# Altium schematic sheet FPGA-Camera-AWR.SchDoc: =ProjectTitle
size A3; Author: Jaime I. Chait; Organization: NWES LLC; Address1: 111 SW 5th Ave, STE 3150; Address2: Portland, OR 97204; SheetNumber: 14; SheetTotal: 19
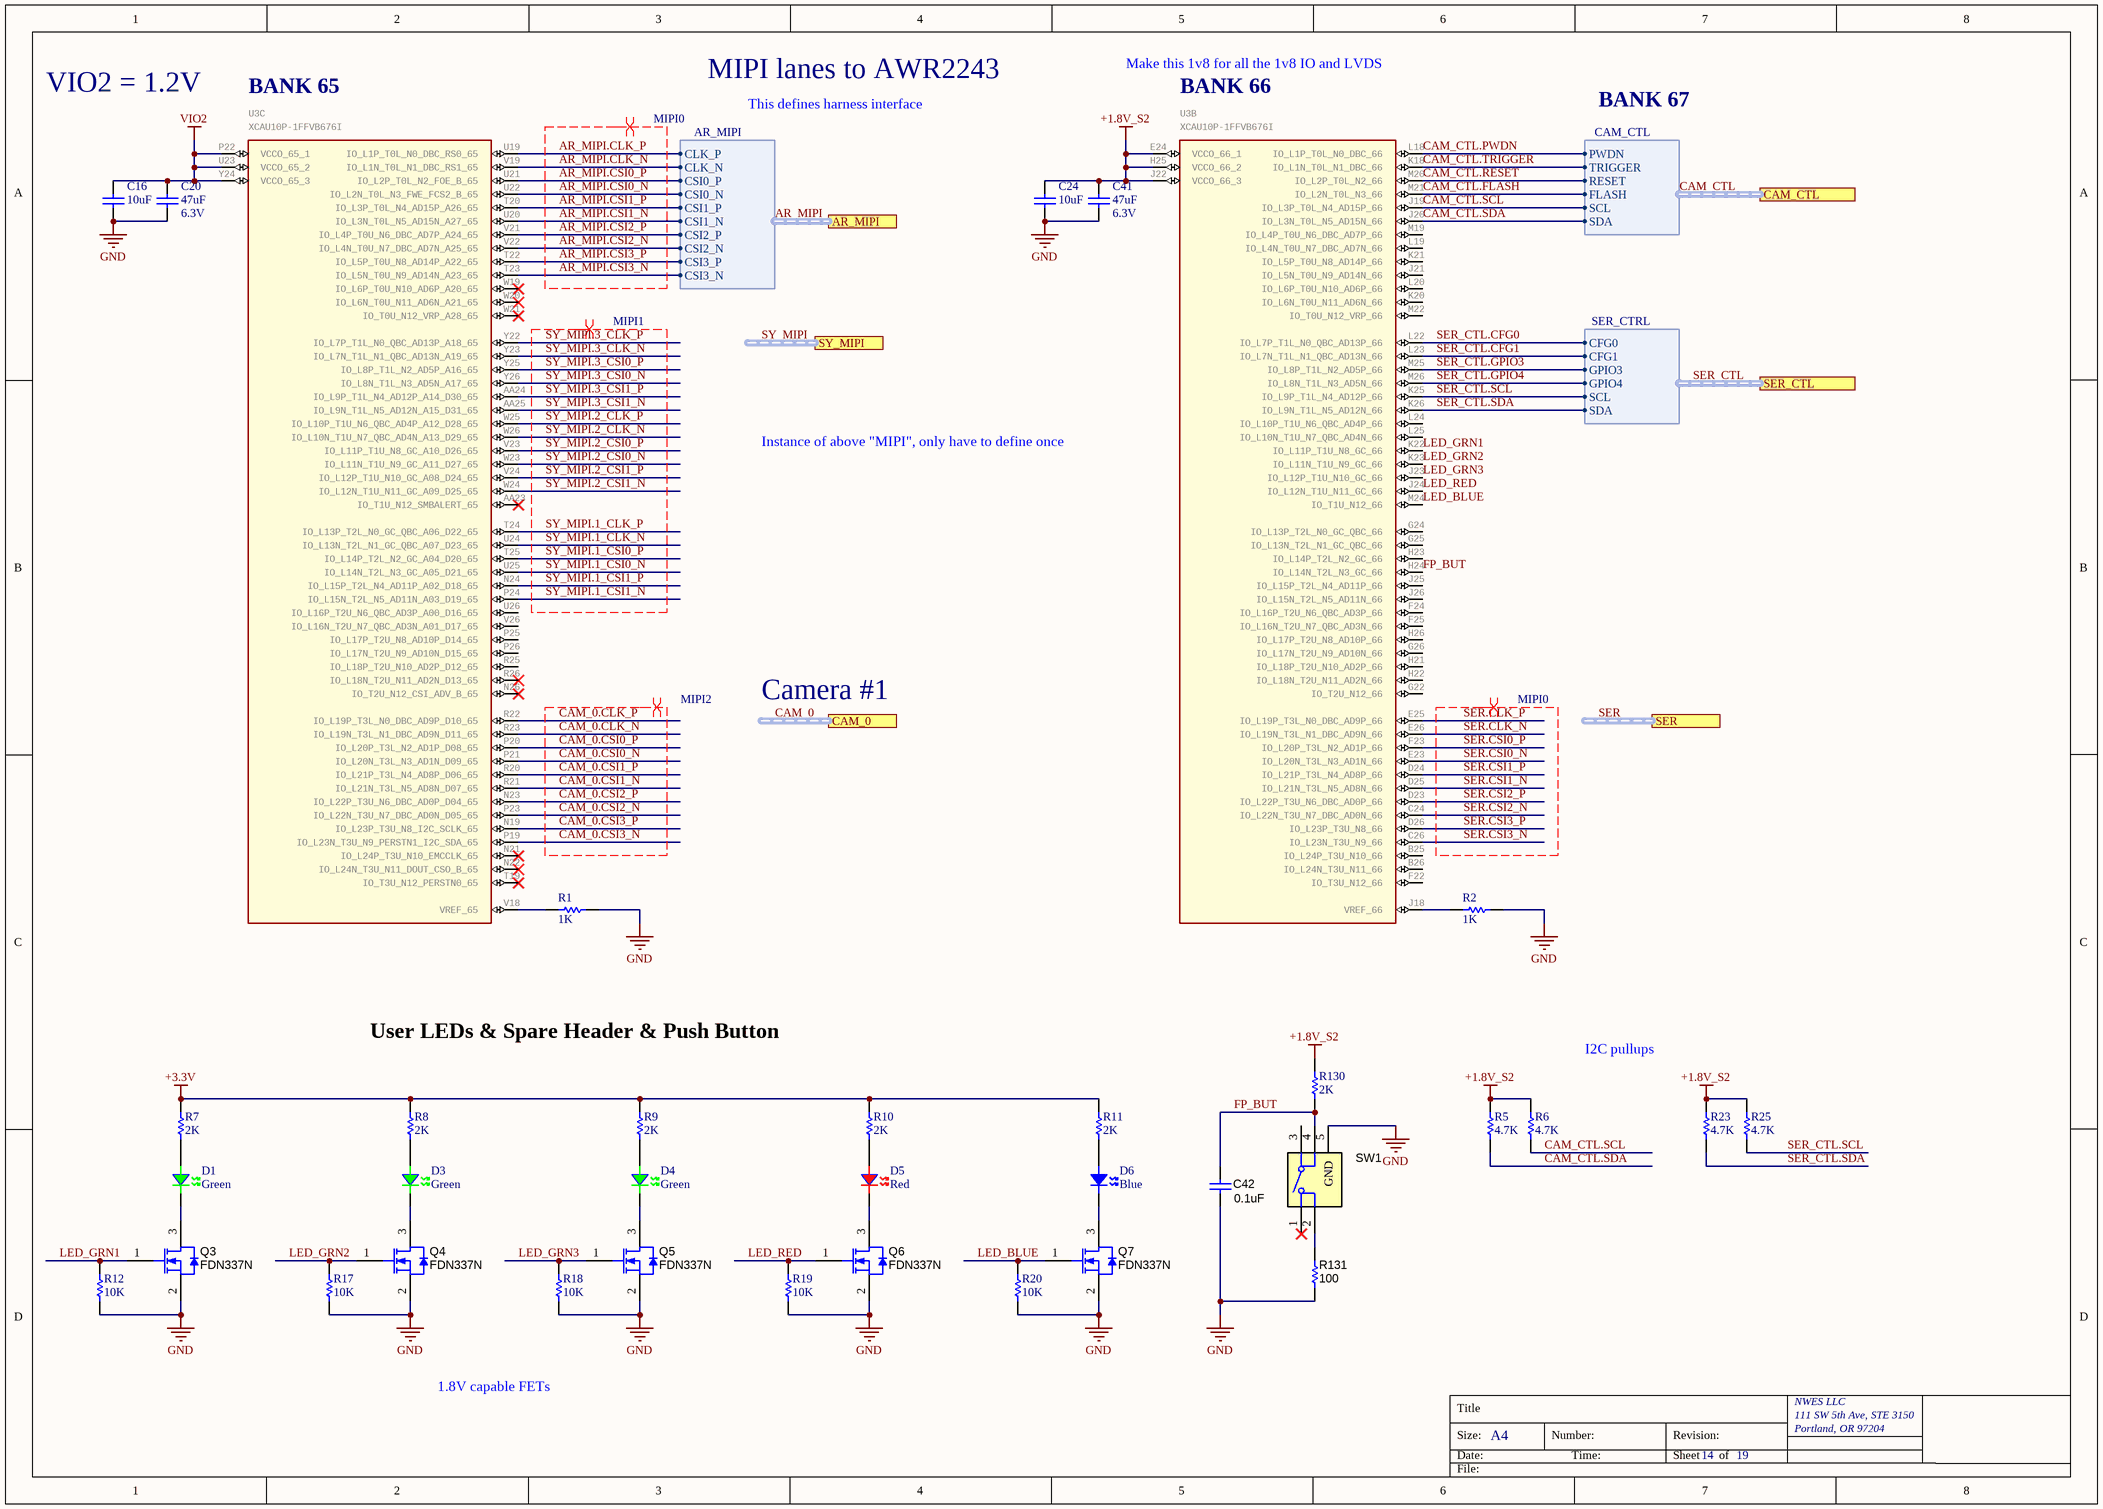
[diagram p0: FPGA-Camera-AWR.SchDoc]

## Parts
C16  10uF  [CAPC1005X90]
C20  47uF  Voltage Rating: 6.3V  [CAPC2012X145USR]
C24  10uF  [CAPC1005X90]
C41  47uF  Voltage Rating: 6.3V  [CAPC2012X145USR]
C42  ValueDisplayed: 0.1uF  [0402L]  (hidden comment: GCM155R71C104KA55D)
D1  Green  [LED_0603]
D3  Green  [LED_0603]
D4  Green  [LED_0603]
D5  Red  [LED_0603]
D6  Blue  [LED_0603]
Q3  FDN337N  [SOT-23]
Q4  FDN337N  [SOT-23]
Q5  FDN337N  [SOT-23]
Q6  FDN337N  [SOT-23]
Q7  FDN337N  [SOT-23]
R1  1K  [RESC1005X40USR]
R2  1K  [RESC1005X40USR]
R5  4.7K  [RESC1005X40USR]
R6  4.7K  [RESC1005X40USR]
R7  2K  [RESC1005X40USR]
R8  2K  [RESC1005X40USR]
R9  2K  [RESC1005X40USR]
R10  2K  [RESC1005X40USR]
R11  2K  [RESC1005X40USR]
R12  10K  [RESC1005X40USR]
R17  10K  [RESC1005X40USR]
R18  10K  [RESC1005X40USR]
R19  10K  [RESC1005X40USR]
R20  10K  [RESC1005X40USR]
R23  4.7K  [RESC1005X40USR]
R25  4.7K  [RESC1005X40USR]
R130  2K  [RESC1005X40USR]
R131  ValueDisplayed: 100  [0402L]  (hidden comment: ERJ-2GEJ101X)
SW1  KMR243GLFG  [SW_KMR243GLFG]  (value not drawn)
U3  XCAU10P-1FFVB676I  [676-FCBGA (27x27)]  (parts B,C of 16)

## Ports
AR_MIPI (harness AR_MIPI), CAM_0 (harness MIPI), CAM_CTL (harness CAM_CTL), SER (harness MIPI), SER_CTL (harness SER_CTRL), SY_MIPI (harness SY_MIPI)

## Harnesses
AR_MIPI: CLK_P, CLK_N, CSI0_P, CSI0_N, CSI1_P, CSI1_N, CSI2_P, CSI2_N, CSI3_P, CSI3_N
CAM_CTL: PWDN, TRIGGER, RESET, FLASH, SCL, SDA
SER_CTRL: CFG0, CFG1, GPIO3, GPIO4, SCL, SDA

## Nets
+1.8V_S2: C24.2 C41.1 R5.2 R6.2 R23.2 R25.2 R130.1 U3.E24(VCCO_66_1) U3.H25(VCCO_66_2) U3.J22(VCCO_66_3)
+3.3V: R7.2 R8.2 R9.2 R10.2 R11.2
GND: C16.1 C20.2 C24.1 C41.2 C42.1 Q3.2(S) Q4.2(S) Q5.2(S) Q6.2(S) Q7.2(S) R1.2 R2.2 R12.1 R17.1 R18.1 R19.1 R20.1 R131.1 SW1.5(GND)
VIO2: C16.2 C20.1 U3.P22(VCCO_65_1) U3.U23(VCCO_65_2) U3.Y24(VCCO_65_3)
AR_MIPI.CLK_N: U3.V19(IO_L1N_T0L_N1_DBC_RS1_65) ; port AR_MIPI.CLK_N
AR_MIPI.CLK_P: U3.U19(IO_L1P_T0L_N0_DBC_RS0_65) ; port AR_MIPI.CLK_P
AR_MIPI.CSI0_N: U3.U22(IO_L2N_T0L_N3_FWE_FCS2_B_65) ; port AR_MIPI.CSI0_N
AR_MIPI.CSI0_P: U3.U21(IO_L2P_T0L_N2_FOE_B_65) ; port AR_MIPI.CSI0_P
AR_MIPI.CSI1_N: U3.U20(IO_L3N_T0L_N5_AD15N_A27_65) ; port AR_MIPI.CSI1_N
AR_MIPI.CSI1_P: U3.T20(IO_L3P_T0L_N4_AD15P_A26_65) ; port AR_MIPI.CSI1_P
AR_MIPI.CSI2_N: U3.V22(IO_L4N_T0U_N7_DBC_AD7N_A25_65) ; port AR_MIPI.CSI2_N
AR_MIPI.CSI2_P: U3.V21(IO_L4P_T0U_N6_DBC_AD7P_A24_65) ; port AR_MIPI.CSI2_P
AR_MIPI.CSI3_N: U3.T23(IO_L5N_T0U_N9_AD14N_A23_65) ; port AR_MIPI.CSI3_N
AR_MIPI.CSI3_P: U3.T22(IO_L5P_T0U_N8_AD14P_A22_65) ; port AR_MIPI.CSI3_P
CAM_0.CLK_N: U3.R23(IO_L19N_T3L_N1_DBC_AD9N_D11_65)
CAM_0.CLK_P: U3.R22(IO_L19P_T3L_N0_DBC_AD9P_D10_65)
CAM_0.CSI0_N: U3.P21(IO_L20N_T3L_N3_AD1N_D09_65)
CAM_0.CSI0_P: U3.P20(IO_L20P_T3L_N2_AD1P_D08_65)
CAM_0.CSI1_N: U3.R21(IO_L21N_T3L_N5_AD8N_D07_65)
CAM_0.CSI1_P: U3.R20(IO_L21P_T3L_N4_AD8P_D06_65)
CAM_0.CSI2_N: U3.P23(IO_L22N_T3U_N7_DBC_AD0N_D05_65)
CAM_0.CSI2_P: U3.N23(IO_L22P_T3U_N6_DBC_AD0P_D04_65)
CAM_0.CSI3_N: U3.P19(IO_L23N_T3U_N9_PERSTN1_I2C_SDA_65)
CAM_0.CSI3_P: U3.N19(IO_L23P_T3U_N8_I2C_SCLK_65)
CAM_CTL.FLASH: U3.M21(IO_L2N_T0L_N3_66) ; port CAM_CTL.FLASH
CAM_CTL.PWDN: U3.L18(IO_L1P_T0L_N0_DBC_66) ; port CAM_CTL.PWDN
CAM_CTL.RESET: U3.M20(IO_L2P_T0L_N2_66) ; port CAM_CTL.RESET
CAM_CTL.SCL: R6.1 U3.J19(IO_L3P_T0L_N4_AD15P_66) ; port CAM_CTL.SCL
CAM_CTL.SDA: R5.1 U3.J20(IO_L3N_T0L_N5_AD15N_66) ; port CAM_CTL.SDA
CAM_CTL.TRIGGER: U3.K18(IO_L1N_T0L_N1_DBC_66) ; port CAM_CTL.TRIGGER
FP_BUT: C42.2 R130.2 SW1.4 U3.H24(IO_L14N_T2L_N3_GC_66)
LED_BLUE: Q7.1(G) R20.2 U3.M24(IO_T1U_N12_66)
LED_GRN1: Q3.1(G) R12.2 U3.K22(IO_L11P_T1U_N8_GC_66)
LED_GRN2: Q4.1(G) R17.2 U3.K23(IO_L11N_T1U_N9_GC_66)
LED_GRN3: Q5.1(G) R18.2 U3.J23(IO_L12P_T1U_N10_GC_66)
LED_RED: Q6.1(G) R19.2 U3.J24(IO_L12N_T1U_N11_GC_66)
SER.CLK_N: U3.E26(IO_L19N_T3L_N1_DBC_AD9N_66)
SER.CLK_P: U3.E25(IO_L19P_T3L_N0_DBC_AD9P_66)
SER.CSI0_N: U3.E23(IO_L20N_T3L_N3_AD1N_66)
SER.CSI0_P: U3.F23(IO_L20P_T3L_N2_AD1P_66)
SER.CSI1_N: U3.D25(IO_L21N_T3L_N5_AD8N_66)
SER.CSI1_P: U3.D24(IO_L21P_T3L_N4_AD8P_66)
SER.CSI2_N: U3.C24(IO_L22N_T3U_N7_DBC_AD0N_66)
SER.CSI2_P: U3.D23(IO_L22P_T3U_N6_DBC_AD0P_66)
SER.CSI3_N: U3.C26(IO_L23N_T3U_N9_66)
SER.CSI3_P: U3.D26(IO_L23P_T3U_N8_66)
SER_CTL.CFG0: U3.L22(IO_L7P_T1L_N0_QBC_AD13P_66) ; port SER_CTL.CFG0
SER_CTL.CFG1: U3.L23(IO_L7N_T1L_N1_QBC_AD13N_66) ; port SER_CTL.CFG1
SER_CTL.GPIO3: U3.M25(IO_L8P_T1L_N2_AD5P_66) ; port SER_CTL.GPIO3
SER_CTL.GPIO4: U3.M26(IO_L8N_T1L_N3_AD5N_66) ; port SER_CTL.GPIO4
SER_CTL.SCL: R25.1 U3.K25(IO_L9P_T1L_N4_AD12P_66) ; port SER_CTL.SCL
SER_CTL.SDA: R23.1 U3.K26(IO_L9N_T1L_N5_AD12N_66) ; port SER_CTL.SDA
SY_MIPI.1_CLK_N: U3.U24(IO_L13N_T2L_N1_GC_QBC_A07_D23_65)
SY_MIPI.1_CLK_P: U3.T24(IO_L13P_T2L_N0_GC_QBC_A06_D22_65)
SY_MIPI.1_CSI0_N: U3.U25(IO_L14N_T2L_N3_GC_A05_D21_65)
SY_MIPI.1_CSI0_P: U3.T25(IO_L14P_T2L_N2_GC_A04_D20_65)
SY_MIPI.1_CSI1_N: U3.P24(IO_L15N_T2L_N5_AD11N_A03_D19_65)
SY_MIPI.1_CSI1_P: U3.N24(IO_L15P_T2L_N4_AD11P_A02_D18_65)
SY_MIPI.2_CLK_N: U3.W26(IO_L10N_T1U_N7_QBC_AD4N_A13_D29_65)
SY_MIPI.2_CLK_P: U3.W25(IO_L10P_T1U_N6_QBC_AD4P_A12_D28_65)
SY_MIPI.2_CSI0_N: U3.W23(IO_L11N_T1U_N9_GC_A11_D27_65)
SY_MIPI.2_CSI0_P: U3.V23(IO_L11P_T1U_N8_GC_A10_D26_65)
SY_MIPI.2_CSI1_N: U3.W24(IO_L12N_T1U_N11_GC_A09_D25_65)
SY_MIPI.2_CSI1_P: U3.V24(IO_L12P_T1U_N10_GC_A08_D24_65)
SY_MIPI.3_CLK_N: U3.Y23(IO_L7N_T1L_N1_QBC_AD13N_A19_65)
SY_MIPI.3_CLK_P: U3.Y22(IO_L7P_T1L_N0_QBC_AD13P_A18_65)
SY_MIPI.3_CSI0_N: U3.Y26(IO_L8N_T1L_N3_AD5N_A17_65)
SY_MIPI.3_CSI0_P: U3.Y25(IO_L8P_T1L_N2_AD5P_A16_65)
SY_MIPI.3_CSI1_N: U3.AA25(IO_L9N_T1L_N5_AD12N_A15_D31_65)
SY_MIPI.3_CSI1_P: U3.AA24(IO_L9P_T1L_N4_AD12P_A14_D30_65)
NetD1_1: D1.1(A) R7.1
NetD1_2: D1.2(K) Q3.3(D)
NetD3_1: D3.1(A) R8.1
NetD3_2: D3.2(K) Q4.3(D)
NetD4_1: D4.1(A) R9.1
NetD4_2: D4.2(K) Q5.3(D)
NetD5_1: D5.1(A) R10.1
NetD5_2: D5.2(K) Q6.3(D)
NetD6_1: D6.1(A) R11.1
NetD6_2: D6.2(K) Q7.3(D)
NetR1_1: R1.1 U3.V18(VREF_65)
NetR2_1: R2.1 U3.J18(VREF_66)
NetR131_2: R131.2 SW1.2

Not connected (* = marked no-connect by the designer): SW1 1* 3; U3 AA23(IO_T1U_N12_SMBALERT_65)* B25(IO_L24P_T3U_N10_66) B26(IO_L24N_T3U_N11_66) F22(IO_T3U_N12_66) F24(IO_L16P_T2U_N6_QBC_AD3P_66) F25(IO_L16N_T2U_N7_QBC_AD3N_66) G22(IO_T2U_N12_66) G24(IO_L13P_T2L_N0_GC_QBC_66) G25(IO_L13N_T2L_N1_GC_QBC_66) G26(IO_L17N_T2U_N9_AD10N_66) H21(IO_L18P_T2U_N10_AD2P_66) H22(IO_L18N_T2U_N11_AD2N_66) H23(IO_L14P_T2L_N2_GC_66) H26(IO_L17P_T2U_N8_AD10P_66) J21(IO_L5N_T0U_N9_AD14N_66) J25(IO_L15P_T2L_N4_AD11P_66) J26(IO_L15N_T2L_N5_AD11N_66) K20(IO_L6N_T0U_N11_AD6N_66) K21(IO_L5P_T0U_N8_AD14P_66) L19(IO_L4N_T0U_N7_DBC_AD7N_66) L20(IO_L6P_T0U_N10_AD6P_66) L24(IO_L10P_T1U_N6_QBC_AD4P_66) L25(IO_L10N_T1U_N7_QBC_AD4N_66) M19(IO_L4P_T0U_N6_DBC_AD7P_66) M22(IO_T0U_N12_VRP_66) N21(IO_L24P_T3U_N10_EMCCLK_65)* N22(IO_L24N_T3U_N11_DOUT_CSO_B_65)* N26(IO_T2U_N12_CSI_ADV_B_65)* P25(IO_L17P_T2U_N8_AD10P_D14_65) P26(IO_L17N_T2U_N9_AD10N_D15_65) R25(IO_L18P_T2U_N10_AD2P_D12_65) R26(IO_L18N_T2U_N11_AD2N_D13_65)* T19(IO_T3U_N12_PERSTN0_65)* U26(IO_L16P_T2U_N6_QBC_AD3P_A00_D16_65) V26(IO_L16N_T2U_N7_QBC_AD3N_A01_D17_65) W19(IO_L6P_T0U_N10_AD6P_A20_65)* W20(IO_L6N_T0U_N11_AD6N_A21_65)* W21(IO_T0U_N12_VRP_A28_65)*

## Buses and harness runs
harness AR_MIPI = port AR_MIPI
harness CAM_0 = port CAM_0
harness CAM_CTL = port CAM_CTL
harness SER = port SER
harness SER_CTL = port SER_CTL
harness SY_MIPI = port SY_MIPI

## Layout directives
differential pair; differential pair class MIPI0: AR_MIPI.CLK_N, AR_MIPI.CLK_P, AR_MIPI.CSI0_N, AR_MIPI.CSI0_P, AR_MIPI.CSI1_N, AR_MIPI.CSI1_P, AR_MIPI.CSI2_N, AR_MIPI.CSI2_P, AR_MIPI.CSI3_N, AR_MIPI.CSI3_P, SER.CLK_N, SER.CLK_P, SER.CSI0_N, SER.CSI0_P, SER.CSI1_N, SER.CSI1_P, SER.CSI2_N, SER.CSI2_P, SER.CSI3_N, SER.CSI3_P
differential pair; differential pair class MIPI1: SY_MIPI.1_CLK_N, SY_MIPI.1_CLK_P, SY_MIPI.1_CSI0_N, SY_MIPI.1_CSI0_P, SY_MIPI.1_CSI1_N, SY_MIPI.1_CSI1_P, SY_MIPI.2_CLK_N, SY_MIPI.2_CLK_P, SY_MIPI.2_CSI0_N, SY_MIPI.2_CSI0_P, SY_MIPI.2_CSI1_N, SY_MIPI.2_CSI1_P, SY_MIPI.3_CLK_N, SY_MIPI.3_CLK_P, SY_MIPI.3_CSI0_N, SY_MIPI.3_CSI0_P, SY_MIPI.3_CSI1_N, SY_MIPI.3_CSI1_P
differential pair; differential pair class MIPI2: CAM_0.CLK_N, CAM_0.CLK_P, CAM_0.CSI0_N, CAM_0.CSI0_P, CAM_0.CSI1_N, CAM_0.CSI1_P, CAM_0.CSI2_N, CAM_0.CSI2_P, CAM_0.CSI3_N, CAM_0.CSI3_P

## Notes on the sheet
- VIO2 = 1.2V
- MIPI lanes to AWR2243
- This defines harness interface
- Make this 1v8 for all the 1v8 IO and LVDS
- BANK 67
- Instance of above "MIPI", only have to define once
- Camera #1
- User LEDs & Spare Header & Push Button
- I2C pullups
- 1.8V capable FETs
- Title
- Size:
- Date:
- A4
- Number:
- Time:
- Revision:
- Sheet
- of
- File:
- (in symbol XCAU10P-1FFVB676I, part B) BANK 66
- (in symbol XCAU10P-1FFVB676I, part C) BANK 65

## Library data of the parts
C16 C24 = CAP CER 10UF 10V X5R 0402: Manufacturer Part Number: CL05A106MP8NUB8; Manufacturer: Samsung Electro-Mechanics; Part #: E-CAP-042; Supplier Part Number 1: 1276-6830-2-ND; Package: 0402; value: 10uF; Supplier 1: Digi-Key; Height: 0.9mm; ComponentLink1Description: New link; ComponentLink1URL: *
C20 C41 = CAP CER 47UF 6.3V X5R 0805: Manufacturer: Samsung; Manufacturer Part Number: CL21A476MQYNNNE; Tolerance: 20%; Supplier 1: Digi-Key; RoHS: Yes; Category: Ceramic Capacitors; Stock 1: 1673694; Pricing 1: 1=0.29000, 10=0.20200, 50=0.13440, 100=0.11420, 500=0.08064, 1000=0.07057 (USD); Mount: Surface Mount; Case/Package: 0805; Case Code (Metric): 2012; Case Code (Imperial): 0805; Contact Plating: Tin; Min Operating Temperature: -55°C; Max Operating Temperature: 85°C; Capacitance: 47uF; Package Quantity: 1; Packaging: Tape and Reel; Dielectric: X5R; Series: CL; Construction: Flat; Length: 2mm; Width: 0.049inch; Height: 1.25mm; Thickness: 0.057inch; Depth: 1.25mm; Radiation Hardening: No; RoHS Compliant: Yes; ComponentLink1URL: https://datasheet.ciiva.com/25791/cl21a476mqynnne-25791153.pdf?src-supplier=Digi-Key; ComponentLink1Description: https://datasheet.ciiva.com/25791/cl21a476mqynnne-25791153.pdf?src-supplier=Digi-Key; ComponentLink2URL: https://datasheet.ciiva.com/26838/getdatasheetpartid-359050-26838632.pdf?src-supplier=Verical; ComponentLink2Description: https://datasheet.ciiva.com/26838/getdatasheetpartid-359050-26838632.pdf?src-supplier=Verical; Supplier Part Number 1: 1276-1852-1-ND
C42 = CMP-0006351-2: CAP, CERM, 0.1 uF, 16 V, +/- 10%, X7R, 0402; Manufacturer: MuRata; TaMin_C: -55°C; Polarized: N; SizeAreaWB_mm2: 3; Value1: Unknown; U/M: EA; Value: 0.1uF; TaMax_C: 125°C; SizeZ_mm: 0.6; SizeX_mm: 1; SizeY_mm: 0.5; Cap_Case: 0402; Value2: 16V; Cap_F: 100nF; AEC Category: Q200; Publisher: Texas Instruments; TempCo: X7R; Published: 2008-06-19; RoHS: Y; MountType: SMT; Supplier 1: Digi-Key; PackageReference: 0402; Tolerance_%: 10%; SizeArea_mm2: 0.5; CompType: Capacitor; LatestRevisionDate: 2017-03-09; PartNumber: GCM155R71C104KA55D; AEC Qualified: ?; VDC_V: 16V; ComponentLink1Description: Datasheet link; Supplier Part Number 1: 490-4759-2-ND; Technology: Ceramic; ComponentLink1URL: http://psearch.murata.com/capacitor/product/GCM155R71C104KA55%23.pdf
D1 D3 D4 = LED GREEN CLEAR SMD 0603: Manufacturer: Vishay Lite-On; Manufacturer Part Number: LTST-C191KGKT; Lens Color: Colorless; Luminous Intensity: 35mcd; Viewing Angle: 130°; Forward Voltage: 2V; Dominant Wavelength: 571nm; Test Current: 20mA; Wavelength: 574nm; Lens Style: Rectangular,Colorless; Forward Current: 30mA; Number of Elements: 1; Power Dissipation: 75mW; Reverse Voltage: 5V; Supplier 1: Digi-Key; RoHS: Yes; Category: Uncategorized; Stock 1: 3115079; Pricing 1: 1=0.26000, 10=0.14100, 100=0.06560, 500=0.06060, 1000=0.04747, 2000=0.04646 (USD); Mount: Surface Mount; Case/Package: 0603; Number of Pins: 2; Color: Green; Case Code (Metric): 1608; Case Code (Imperial): 0603; Min Operating Temperature: -55°C; Max Operating Temperature: 85°C; Packaging: Tape and Reel; Package Quantity: 1; Lens Transparency: Clear; Illumination Color: Green; Number of LEDs: 1; Power Rating: 75mW; Max Power Dissipation: 75mW; Length: 1.6mm; Width: 0.8mm; Height: 0.55mm; Depth: 0.8mm; Radiation Hardening: No; RoHS Compliant: Yes; Lead Free: Lead Free; ComponentLink1URL: https://datasheet.ciiva.com/2109/ltst-c191kgkt-2109973.pdf?src-supplier=Digi-Key; ComponentLink1Description: https://datasheet.ciiva.com/2109/ltst-c191kgkt-2109973.pdf?src-supplier=Digi-Key; Supplier Part Number 1: 160-1446-1-ND
D5 = LED RED CLEAR CHIP SMD 0603: Manufacturer: Vishay Lite-On; Manufacturer Part Number: LTST-C190KRKT; Lens Color: Colorless; Luminous Intensity: 54mcd; Forward Current: 30mA; Viewing Angle: 130°; Forward Voltage: 2.4V; Lens Style: Diffused,Colorless,Clear,Rectangular; Power Rating: 75mW; Dominant Wavelength: 631nm; Test Current: 20mA; Number of Elements: 1; Wavelength: 639nm; Reverse Voltage: 5V; Supplier 1: Digi-Key; RoHS: Yes; Category: LEDs; Stock 1: 1046012; Pricing 1: 1=0.24000, 10=0.13200, 100=0.06110, 500=0.05640, 1000=0.04418, 2000=0.04324 (USD); Mount: Surface Mount; Case/Package: 0603; Number of Pins: 2; Color: Red; Case Code (Metric): 1608; Case Code (Imperial): 0603; Min Operating Temperature: -55°C; Max Operating Temperature: 85°C; Packaging: Tape and Reel; Package Quantity: 1; Illumination Color: Red; Lens Transparency: Clear; Power Dissipation: 75mW; Number of LEDs: 1; Length: 1.6mm; Width: 0.8mm; Height: 0.8mm; Depth: 0.8mm; Radiation Hardening: No; Lead Free: Lead Free; RoHS Compliant: Yes; ComponentLink1URL: https://datasheet.ciiva.com/19482/1260381-19482354.pdf?src-supplier=Jameco; ComponentLink1Description: https://datasheet.ciiva.com/19482/1260381-19482354.pdf?src-supplier=Jameco; ComponentLink2URL: https://datasheet.ciiva.com/11774/0900766b80dc02a9-11774043.pdf?src-supplier=RSComponents; ComponentLink2Description: https://datasheet.ciiva.com/11774/0900766b80dc02a9-11774043.pdf?src-supplier=RSComponents; ComponentLink3URL: https://datasheet.ciiva.com/12403/100-ltst-c190krkt-59805-12403895.pdf?src-supplier=Mouser; ComponentLink3Description: https://datasheet.ciiva.com/12403/100-ltst-c190krkt-59805-12403895.pdf?src-supplier=Mouser; ComponentLink4URL: https://datasheet.ciiva.com/16427/ltst-c190krkt-16427674.pdf?src-supplier=Future+Electronics; ComponentLink4Description: https://datasheet.ciiva.com/16427/ltst-c190krkt-16427674.pdf?src-supplier=Future+Electronics; ComponentLink5URL: https://datasheet.ciiva.com/15117/getdatasheetpartid-57395-15117240.pdf?src-supplier=Verical; ComponentLink5Description: https://datasheet.ciiva.com/15117/getdatasheetpartid-57395-15117240.pdf?src-supplier=Verical; ComponentLink6URL: https://datasheet.ciiva.com/2109/s-110-ltst-c190krkt-2109992.pdf?src-supplier=Digi-Key; ComponentLink6Description: https://datasheet.ciiva.com/2109/s-110-ltst-c190krkt-2109992.pdf?src-supplier=Digi-Key; ComponentLink7URL: https://datasheet.ciiva.com/2109/s-110-ltst-c190krkt-2109991.pdf?src-supplier=Digi-Key; ComponentLink7Description: https://datasheet.ciiva.com/2109/s-110-ltst-c190krkt-2109991.pdf?src-supplier=Digi-Key; ComponentLink8URL: https://datasheet.ciiva.com/2109/s-110-ltst-c190krkt-2109993.pdf?src-supplier=Digi-Key; ComponentLink8Description: https://datasheet.ciiva.com/2109/s-110-ltst-c190krkt-2109993.pdf?src-supplier=Digi-Key; ComponentLink9URL: https://datasheet.ciiva.com/26937/getdatasheetpartid-631582-26937958.pdf?src-supplier=Verical; ComponentLink9Description: https://datasheet.ciiva.com/26937/getdatasheetpartid-631582-26937958.pdf?src-supplier=Verical; Supplier Part Number 1: 160-1436-1-ND
D6 = LED BLUE CLEAR CHIP SMD 0603: LED BLUE CLEAR 0603 SMD; Manufacturer: Vishay Lite-On; Manufacturer Part Number: LTST-C191TBKT; Lens Color: Colorless; Viewing Angle: 130°; Lens Style: Diffused,Colorless,Clear,Rectangular; Forward Voltage: 3.8V; Luminous Intensity: 180mcd; Dominant Wavelength: 475nm; Test Current: 20mA; Number of LEDs: 1; Wavelength: 468nm; Reverse Voltage: 5V; Max Power Dissipation: 75mW; Power Dissipation: 76mW; Supplier 1: Digi-Key; RoHS: Yes; Category: LEDs; Stock 1: 577602; Pricing 1: 1=0.33000, 10=0.26200, 100=0.11780, 500=0.10640, 1000=0.08740, 2000=0.07600 (USD); Mount: Surface Mount; Case/Package: 0603; Number of Pins: 2; Color: Blue; Case Code (Metric): 1608; Case Code (Imperial): 0603; Min Operating Temperature: -20°C; Max Operating Temperature: 80°C; Packaging: Tape and Reel; Package Quantity: 1; Lens Transparency: Clear; Forward Current: 20mA; Illumination Color: Blue; Number of Elements: 1; Length: 0.8mm; Width: 0.8mm; Height: 0.55mm; Depth: 1.6mm; Radiation Hardening: No; RoHS Compliant: Yes; Lead Free: Lead Free; ComponentLink1URL: https://datasheet.ciiva.com/2110/ltst-c191tbkt-2110256.pdf?src-supplier=Digi-Key; ComponentLink1Description: https://datasheet.ciiva.com/2110/ltst-c191tbkt-2110256.pdf?src-supplier=Digi-Key; ComponentLink2URL: https://datasheet.ciiva.com/19465/2047945-19465673.pdf?src-supplier=Jameco; ComponentLink2Description: https://datasheet.ciiva.com/19465/2047945-19465673.pdf?src-supplier=Jameco; ComponentLink3URL: https://datasheet.ciiva.com/11774/0900766b80dc02b4-11774413.pdf?src-supplier=RSComponents; ComponentLink3Description: https://datasheet.ciiva.com/11774/0900766b80dc02b4-11774413.pdf?src-supplier=RSComponents; ComponentLink4URL: https://datasheet.ciiva.com/12400/lite-on-ltst-c191tbkt-187207-12400737.pdf?src-supplier=Mouser; ComponentLink4Description: https://datasheet.ciiva.com/12400/lite-on-ltst-c191tbkt-187207-12400737.pdf?src-supplier=Mouser; ComponentLink5URL: https://datasheet.ciiva.com/16444/ltst-c191tbkt-16444756.pdf?src-supplier=Future+Electronics; ComponentLink5Description: https://datasheet.ciiva.com/16444/ltst-c191tbkt-16444756.pdf?src-supplier=Future+Electronics; ComponentLink6URL: https://datasheet.ciiva.com/15117/getdatasheetpartid-133342-15117680.pdf?src-supplier=Verical; ComponentLink6Description: https://datasheet.ciiva.com/15117/getdatasheetpartid-133342-15117680.pdf?src-supplier=Verical; ComponentLink7URL: https://datasheet.ciiva.com/2110/s-110-ltst-c191tbkt-2110257.pdf?src-supplier=Digi-Key; ComponentLink7Description: https://datasheet.ciiva.com/2110/s-110-ltst-c191tbkt-2110257.pdf?src-supplier=Digi-Key; Supplier Part Number 1: 160-1647-1-ND
Q3-Q7 = MOSFET N-CH 30V 2.2A SUPERSOT3: MOSFET N-CH 30V 2.2A SSOT3; Manufacturer: ON Semiconductor / Fairchild; Drain to Source Resistance: 65mR; Gate to Source Voltage (Vgs): 8V; Power Dissipation: 500mW; Turn-Off Delay Time: 17ns; Element Configuration: Single; Rise Time: 10ns; Turn-On Delay Time: 4ns; Input Capacitance: 300pF; Number of Elements: 1; Threshold Voltage: 700mV; Polarity: N-CHANNEL; Supplier 1: Digi-Key; Manufacturer Part Number: FDN337N; RoHS: Yes; Category: MOSFETs; Stock 1: 48367; Pricing 1: 1=0.49000, 10=0.42000, 100=0.31350, 500=0.24636, 1000=0.19037 (USD); Mount: Surface Mount; Case/Package: TO-236-3; Number of Pins: 3; Contact Plating: Tin,Matte; Weight: 0.03g; Min Operating Temperature: -55°C; Max Operating Temperature: 150°C; Continuous Drain Current (ID): 2.2A; Packaging: Tape and Reel; Drain to Source Breakdown Voltage: 30V; Max Power Dissipation: 500mW; Drain to Source Voltage (Vdss): 30V; Fall Time: 10ns; Package Quantity: 3000; Rds On Max: 65mR; Voltage Rating (DC): 30V; Current Rating: 2.2A; On-State Resistance: 65mR; Series: -; Drain-source On Resistance-Max: 65mR; Dual Supply Voltage: 30V; Termination: SMD/SMT; Nominal Vgs: 700mV; Length: 2.92mm; Width: 3.05mm; Height: 0.94mm; Lead Free: Lead Free; RoHS Compliant: Yes; Reach SVHC Compliant: Yes; ComponentLink1URL: https://datasheet.ciiva.com/14092/fdn337n-eng-datasheet-14092051.pdf?src-supplier=Distrelec; ComponentLink1Description: https://datasheet.ciiva.com/14092/fdn337n-eng-datasheet-14092051.pdf?src-supplier=Distrelec; ComponentLink2URL: https://datasheet.ciiva.com/4442/fdn337n-44286-4442315.pdf?src-supplier=Mouser; ComponentLink2Description: https://datasheet.ciiva.com/4442/fdn337n-44286-4442315.pdf?src-supplier=Mouser; ComponentLink3URL: https://datasheet.ciiva.com/19470/871017-19470804.pdf?src-supplier=Jameco; ComponentLink3Description: https://datasheet.ciiva.com/19470/871017-19470804.pdf?src-supplier=Jameco; ComponentLink4URL: https://datasheet.ciiva.com/6037/fdn337n-6037720.pdf?src-supplier=Farnell; ComponentLink4Description: https://datasheet.ciiva.com/6037/fdn337n-6037720.pdf?src-supplier=Farnell; ComponentLink5URL: https://datasheet.ciiva.com/22681/220571-22681884.pdf?src-supplier=Element14; ComponentLink5Description: https://datasheet.ciiva.com/22681/220571-22681884.pdf?src-supplier=Element14; ComponentLink6URL: https://datasheet.ciiva.com/22655/220571-22655333.pdf?src-supplier=Element14; ComponentLink6Description: https://datasheet.ciiva.com/22655/220571-22655333.pdf?src-supplier=Element14; ComponentLink7URL: https://datasheet.ciiva.com/7968/220571-7968126.pdf?src-supplier=Element14; ComponentLink7Description: https://datasheet.ciiva.com/7968/220571-7968126.pdf?src-supplier=Element14; ComponentLink8URL: https://datasheet.ciiva.com/8115/fdn337n-8115069.pdf?src-supplier=Avnet; ComponentLink8Description: https://datasheet.ciiva.com/8115/fdn337n-8115069.pdf?src-supplier=Avnet; ComponentLink9URL: https://datasheet.ciiva.com/16931/fdn337n-16931214.pdf?src-supplier=Future+Electronics; ComponentLink9Description: https://datasheet.ciiva.com/16931/fdn337n-16931214.pdf?src-supplier=Future+Electronics; ComponentLink10URL: https://datasheet.ciiva.com/8115/fdn337n-8115063.pdf?src-supplier=Avnet; ComponentLink10Description: https://datasheet.ciiva.com/8115/fdn337n-8115063.pdf?src-supplier=Avnet; ComponentLink11URL: https://datasheet.ciiva.com/931/fdn337n-931876.pdf?src-supplier=Digi-Key; ComponentLink11Description: https://datasheet.ciiva.com/931/fdn337n-931876.pdf?src-supplier=Digi-Key; ComponentLink12URL: https://datasheet.ciiva.com/931/fdn337n-931877.pdf?src-supplier=Digi-Key; ComponentLink12Description: https://datasheet.ciiva.com/931/fdn337n-931877.pdf?src-supplier=Digi-Key; ComponentLink13URL: https://datasheet.ciiva.com/931/fdn337n-931875.pdf?src-supplier=Digi-Key; ComponentLink13Description: https://datasheet.ciiva.com/931/fdn337n-931875.pdf?src-supplier=Digi-Key; Supplier Part Number 1: FDN337NCT-ND
R1 R2 = RES 1K OHM 1% 1/16W 0402: Manufacturer: YAGEO; Manufacturer Part Number: RC0402FR-071KL; Supplier Part Number 1: 311-1.00KLRCT-ND; Supplier 1: Digi-Key; Height: 0.4mm; Package: 0402; value: 1K
R5 R6 R23 R25 = RES 4.7K OHM 1% 1/16W 0402: Manufacturer: YAGEO; Manufacturer Part Number: RC0402FR-074K7L; Supplier Part Number 1: 311-4.7KLRCT-ND; Supplier 1: Digi-Key; Height: 0.4mm; Package: 0402; value: 4.7K
R7-R11 R130 = RES 2K OHM 1% 1/16W 0402: Manufacturer: YAGEO; Manufacturer Part Number: RC0402FR-072KL; Supplier Part Number 1: 311-2KLRCT-ND; Supplier 1: Digi-Key; Height: 0.4mm; Package: 0402; value: 2K
R12 R17-R20 = RES 10K OHM 1% 1/16W 0402: Manufacturer: YAGEO; Manufacturer Part Number: RC0402FR-0710KL; Supplier Part Number 1: 311-10.0KLRCT-ND; Package: 0402; Height: 0.4mm; Supplier 1: Digi-Key; value: 10K; Tolerance: ±1%
R131 = CMP-0026993-2: RES, 100, 5%, 0.1 W, AEC-Q200 Grade 0, 0402; Manufacturer: Panasonic; Power_W: 100mW; TempCo: 200 ppm/C; Value_Code: 100R; U/M: EA; Value: 100; EIA_Code: E24; SizeX_mm: 1; SizeY_mm: 0.5; SizeZ_mm: 0.6; Value2: 0.1W; CompType: Resistor; AEC Qualified: Y; AEC Grade: 0; AEC Category: Q200; Supplier Part Number 2: 65T8246; Publisher: Texas Instruments; Supplier 2: Newark; Supplier Part Number 3: 2059210; Supplier 3: Farnell; Published: 2008-06-26; RoHS: Y; Value1: 5%; MountType: SMT; Supplier 1: Digi-Key; PackageReference: 0402; Tolerance_%: 5%; Res_ohm: 100; SizeArea_mm2: 0.5; LatestRevisionDate: 2017-03-09; PartNumber: ERJ-2GEJ101X; ComponentLink1Description: Datasheet link; Supplier Part Number 1: P100JCT-ND; Technology: Thick Film; ComponentLink1URL: https://industrial.panasonic.com/cdbs/www-data/pdf/RDA0000/AOA0000C84.pdf
SW1 = CMP-0002325-1: Switch, SPST-NO, Off-Mom, 0.01 A, 32 VDC, SMD; Manufacturer: C&K Components; CurrentRating_mA: 10A; PositionCount: 1; SizeX_mm: 4.6; SizeY_mm: 2.8; SizeZ_mm: 1.9; SizeArea_mm2: 12.88; VDC_V: 32V; SizeAreaWB_mm2: 21.28; Supplier 2: Mouser; Supplier 1: Digi-Key; Supplier Part Number 1: 401-1432-2-ND; Supplier Part Number 2: 611-KMR243GLFG; PartNumber: KMR243GLFG; ComponentLink1Description: Datasheet URL; LatestRevisionDate: 2017-03-09; ComponentLink1URL: http://www.ckswitches.com/media/1479/kmr2.pdf; CompType: Switch; Publisher: Texas Instruments; Circuit: SPST-NO; RoHS: Y; Orientation: Top Actuated; SwitchFunction: Off-Mom; PackageReference: 4.2x2.8mm; MountType: SMT
U3 = XCAU10P-1FFVB676I: IC FPGA ARTIXUP 676BGA; Manufacturer: AMD Xilinx; Manufacturer Part Number: XCAU10P-1FFVB676I; Supplier Part Number 1: 122-XCAU10P-1FFVB676I-ND; Supplier 1: Supplier